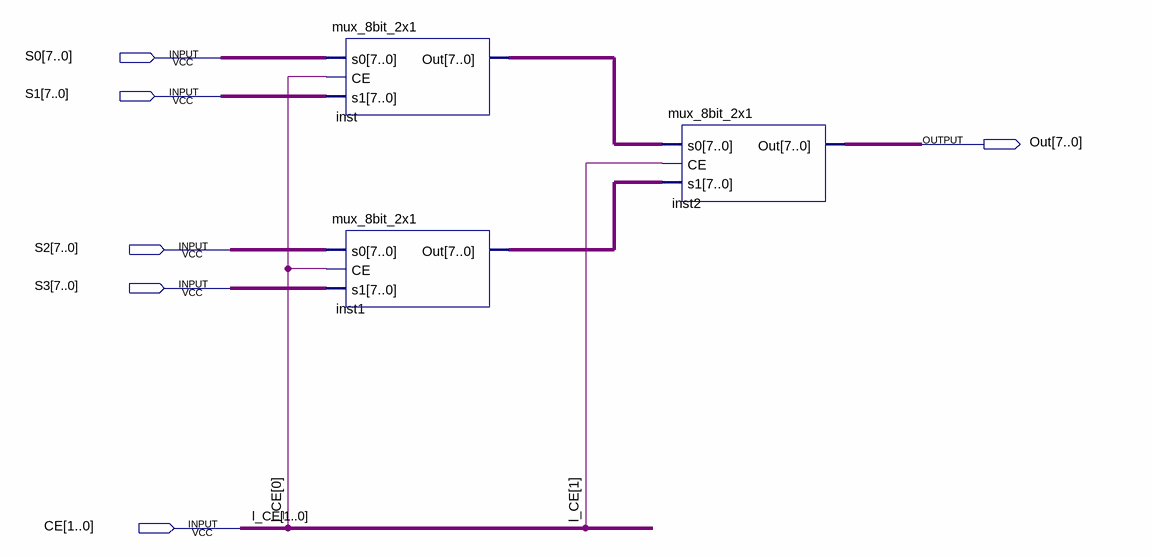
[diagram p0: schematic sheet]
// Quartus schematic mux_8bit_4x1.bdf as structural Verilog: 3 symbols, 6 pins
module mux_8bit_4x1 (
  input  [7:0] S0,
  input  [7:0] S1,
  input  [7:0] S2,
  input  [7:0] S3,
  input  [1:0] CE,
  output [7:0] Out
);

  wire [7:0] inst1_out, inst_out;

  mux_8bit_2x1 inst (.s0(S0), .CE(CE[0]), .s1(S1), .Out(inst_out));
  mux_8bit_2x1 inst1 (.s0(S2), .CE(CE[0]), .s1(S3), .Out(inst1_out));
  mux_8bit_2x1 inst2 (.s0(inst_out), .CE(CE[1]), .s1(inst1_out), .Out(Out));

  // Other names for the same wires on the sheet: l_CE[1:0] = CE
endmodule
